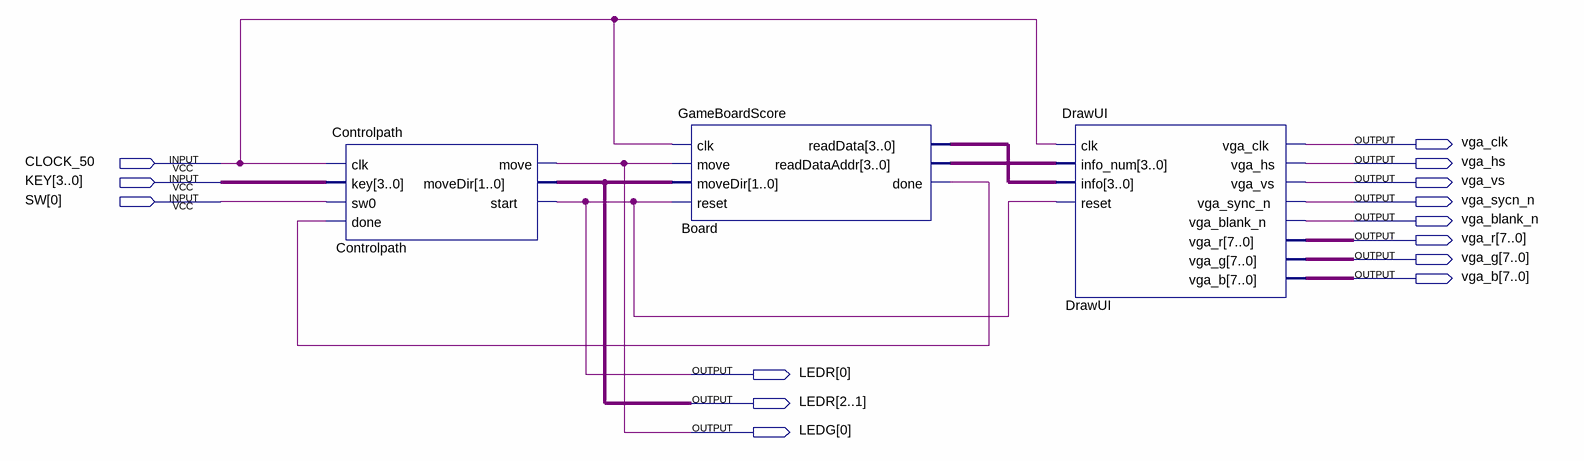
[diagram p0: schematic sheet]
// Quartus schematic Game2048.bdf as structural Verilog: 3 symbols, 14 pins
module Game2048 (
  input  CLOCK_50,
  input  [3:0] KEY,
  input  [0:0] SW,
  output vga_clk,
  output vga_hs,
  output vga_vs,
  output vga_sycn_n,
  output vga_blank_n,
  output [7:0] vga_r,
  output [7:0] vga_g,
  output [7:0] vga_b,
  output [2:0] LEDR,
  output [0:0] LEDG
);

  wire Board_done;
  wire [3:0] Board_readdata, Board_readdataaddr;

  Controlpath Controlpath (
    .clk(CLOCK_50), .key(KEY), .sw0(SW[0]), .done(Board_done), .move(LEDG[0]), .moveDir(LEDR[2:1]),
    .start(LEDR[0]));
  GameBoardScore Board (
    .clk(CLOCK_50), .move(LEDG[0]), .moveDir(LEDR[2:1]), .reset(LEDR[0]), .readData(Board_readdata),
    .readDataAddr(Board_readdataaddr), .done(Board_done));
  DrawUI DrawUI (
    .clk(CLOCK_50), .info_num(Board_readdataaddr), .info(Board_readdata), .reset(LEDR[0]), .vga_clk(vga_clk),
    .vga_hs(vga_hs), .vga_vs(vga_vs), .vga_sync_n(vga_sycn_n), .vga_blank_n(vga_blank_n), .vga_r(vga_r),
    .vga_g(vga_g), .vga_b(vga_b));
endmodule
